# Altium schematic sheet Sensor-Connector.SchDoc
size A3; DocumentNumber: 5; SheetNumber: 5; SheetTotal: 9; PageSetup: Record=PageOptions|CenterHorizontal=True|CenterVertical=True|PrintScale=0.97|XCorrection=1.00|YCorrection=1.00|PrintKind=1|BorderSize=5000000|LeftOffset=0|BottomOffset=0|Orientation=2|PaperLength=2970|PaperWidth=2100|Scale=100|PaperSource=7|PrintQuality=600|MediaType=1|DitherType=10|PaperKind=A4|PrintScaleMode=1
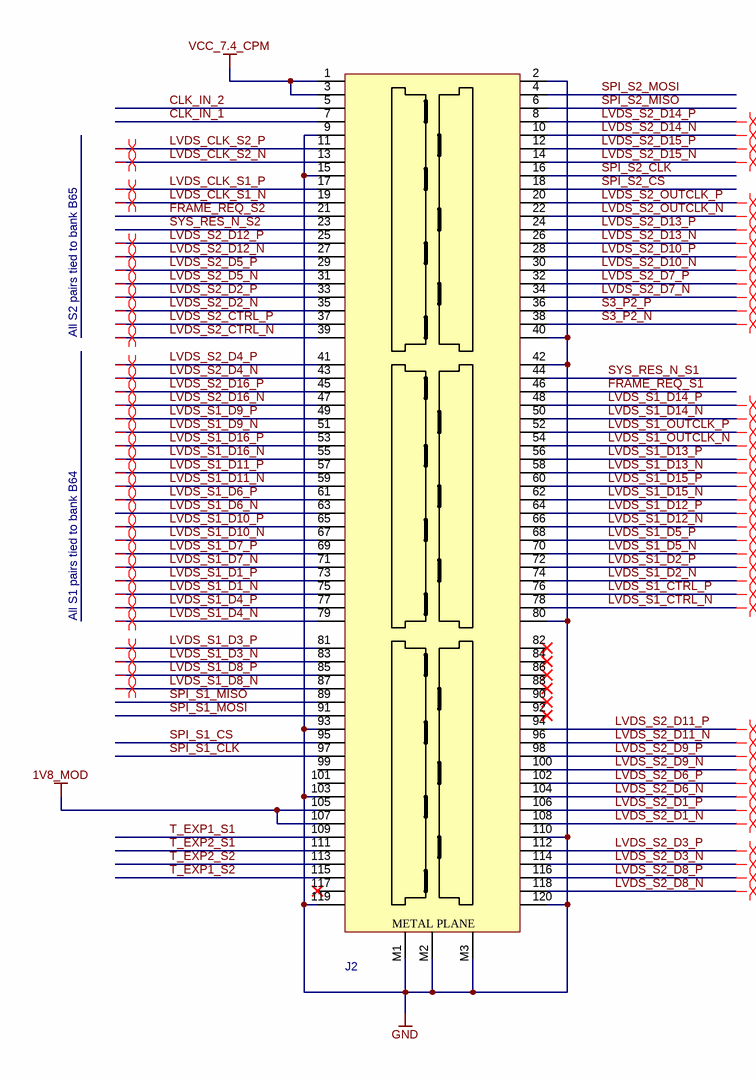
[diagram p0: Sensor-Connector.SchDoc]

## Parts
J2  QSE-060-01-L-D-A  [QSE-060-01-L-D-A]  (value not drawn)

## Nets
1V8_MOD: J2.105 J2.107
GND: J2.2 J2.9 J2.15 J2.40 J2.42 J2.80 J2.93 J2.103 J2.110 J2.119 J2.120 J2.M1 J2.M2 J2.M3
VCC_7.4_CPM: J2.1 J2.3
CLK_IN_1: J2.7
CLK_IN_2: J2.5
FRAME_REQ_S1: J2.46
FRAME_REQ_S2: J2.21
LVDS_CLK_S1_N: J2.19
LVDS_CLK_S1_P: J2.17
LVDS_CLK_S2_N: J2.13
LVDS_CLK_S2_P: J2.11
LVDS_S1_CTRL_N: J2.78
LVDS_S1_CTRL_P: J2.76
LVDS_S1_D1_N: J2.75
LVDS_S1_D1_P: J2.73
LVDS_S1_D2_N: J2.74
LVDS_S1_D2_P: J2.72
LVDS_S1_D3_N: J2.83
LVDS_S1_D3_P: J2.81
LVDS_S1_D4_N: J2.79
LVDS_S1_D4_P: J2.77
LVDS_S1_D5_N: J2.70
LVDS_S1_D5_P: J2.68
LVDS_S1_D6_N: J2.63
LVDS_S1_D6_P: J2.61
LVDS_S1_D7_N: J2.71
LVDS_S1_D7_P: J2.69
LVDS_S1_D8_N: J2.87
LVDS_S1_D8_P: J2.85
LVDS_S1_D9_N: J2.51
LVDS_S1_D9_P: J2.49
LVDS_S1_D10_N: J2.67
LVDS_S1_D10_P: J2.65
LVDS_S1_D11_N: J2.59
LVDS_S1_D11_P: J2.57
LVDS_S1_D12_N: J2.66
LVDS_S1_D12_P: J2.64
LVDS_S1_D13_N: J2.58
LVDS_S1_D13_P: J2.56
LVDS_S1_D14_N: J2.50
LVDS_S1_D14_P: J2.48
LVDS_S1_D15_N: J2.62
LVDS_S1_D15_P: J2.60
LVDS_S1_D16_N: J2.55
LVDS_S1_D16_P: J2.53
LVDS_S1_OUTCLK_N: J2.54
LVDS_S1_OUTCLK_P: J2.52
LVDS_S2_CTRL_N: J2.39
LVDS_S2_CTRL_P: J2.37
LVDS_S2_D1_N: J2.108
LVDS_S2_D1_P: J2.106
LVDS_S2_D2_N: J2.35
LVDS_S2_D2_P: J2.33
LVDS_S2_D3_N: J2.114
LVDS_S2_D3_P: J2.112
LVDS_S2_D4_N: J2.43
LVDS_S2_D4_P: J2.41
LVDS_S2_D5_N: J2.31
LVDS_S2_D5_P: J2.29
LVDS_S2_D6_N: J2.104
LVDS_S2_D6_P: J2.102
LVDS_S2_D7_N: J2.34
LVDS_S2_D7_P: J2.32
LVDS_S2_D8_N: J2.118
LVDS_S2_D8_P: J2.116
LVDS_S2_D9_N: J2.100
LVDS_S2_D9_P: J2.98
LVDS_S2_D10_N: J2.30
LVDS_S2_D10_P: J2.28
LVDS_S2_D11_N: J2.96
LVDS_S2_D11_P: J2.94
LVDS_S2_D12_N: J2.27
LVDS_S2_D12_P: J2.25
LVDS_S2_D13_N: J2.26
LVDS_S2_D13_P: J2.24
LVDS_S2_D14_N: J2.10
LVDS_S2_D14_P: J2.8
LVDS_S2_D15_N: J2.14
LVDS_S2_D15_P: J2.12
LVDS_S2_D16_N: J2.47
LVDS_S2_D16_P: J2.45
LVDS_S2_OUTCLK_N: J2.22
LVDS_S2_OUTCLK_P: J2.20
S3_P2_N: J2.38
S3_P2_P: J2.36
SPI_S1_CLK: J2.97
SPI_S1_CS: J2.95
SPI_S1_MISO: J2.89
SPI_S1_MOSI: J2.91
SPI_S2_CLK: J2.16
SPI_S2_CS: J2.18
SPI_S2_MISO: J2.6
SPI_S2_MOSI: J2.4
SYS_RES_N_S1: J2.44
SYS_RES_N_S2: J2.23
T_EXP1_S1: J2.109
T_EXP1_S2: J2.115
T_EXP2_S1: J2.111
T_EXP2_S2: J2.113

Not connected (* = marked no-connect by the designer): J2 82* 84* 86* 88* 90* 92* 99 101 117*

## Layout directives
differential pair: LVDS_CLK_S1_N, LVDS_CLK_S1_P, LVDS_CLK_S2_N, LVDS_CLK_S2_P, LVDS_S1_CTRL_N, LVDS_S1_CTRL_P, LVDS_S1_D1_N, LVDS_S1_D1_P, LVDS_S1_D2_N, LVDS_S1_D2_P, LVDS_S1_D3_N, LVDS_S1_D3_P, LVDS_S1_D4_N, LVDS_S1_D4_P, LVDS_S1_D5_N, LVDS_S1_D5_P, LVDS_S1_D6_N, LVDS_S1_D6_P, LVDS_S1_D7_N, LVDS_S1_D7_P, LVDS_S1_D8_N, LVDS_S1_D8_P, LVDS_S1_D9_N, LVDS_S1_D9_P, LVDS_S1_D10_N, LVDS_S1_D10_P, LVDS_S1_D11_N, LVDS_S1_D11_P, LVDS_S1_D12_N, LVDS_S1_D12_P, LVDS_S1_D13_N, LVDS_S1_D13_P, LVDS_S1_D14_N, LVDS_S1_D14_P, LVDS_S1_D15_N, LVDS_S1_D15_P, LVDS_S1_D16_N, LVDS_S1_D16_P, LVDS_S1_OUTCLK_N, LVDS_S1_OUTCLK_P, LVDS_S2_CTRL_N, LVDS_S2_CTRL_P, LVDS_S2_D1_N, LVDS_S2_D1_P, LVDS_S2_D2_N, LVDS_S2_D2_P, LVDS_S2_D3_N, LVDS_S2_D3_P, LVDS_S2_D4_N, LVDS_S2_D4_P, LVDS_S2_D5_N, LVDS_S2_D5_P, LVDS_S2_D6_N, LVDS_S2_D6_P, LVDS_S2_D7_N, LVDS_S2_D7_P, LVDS_S2_D8_N, LVDS_S2_D8_P, LVDS_S2_D9_N, LVDS_S2_D9_P, LVDS_S2_D10_N, LVDS_S2_D10_P, LVDS_S2_D11_N, LVDS_S2_D11_P, LVDS_S2_D12_N, LVDS_S2_D12_P, LVDS_S2_D13_N, LVDS_S2_D13_P, LVDS_S2_D14_N, LVDS_S2_D14_P, LVDS_S2_D15_N, LVDS_S2_D15_P, LVDS_S2_D16_N, LVDS_S2_D16_P, LVDS_S2_OUTCLK_N, LVDS_S2_OUTCLK_P, S3_P2_N, S3_P2_P

## Notes on the sheet
- All S2 pairs tied to bank B65
- All S1 pairs tied to bank B64
- Title:
- Size:
- Date:
- A3
- Revision:
- Page:
- of
- Antmicro Ltd.
- File:
- www.antmicro.com
- (in symbol QSE-060-01-L-D-A) METAL PLANE

## Library data of the parts
J2 = QSE-060-01-L-D-A: SAMTEC 	QSE-60-01-L-D-A  Stacking Board Connector, Dual Row, QSE Series, Receptacle, 0.8 m, 120 Contacts, Surface Mount; Value: QSE-060-01-L-D-A; Manufacturer: SAMTEC; MPN: QSE-060-01-L-D-A